# Altium schematic sheet MCU.SchDoc
size A4
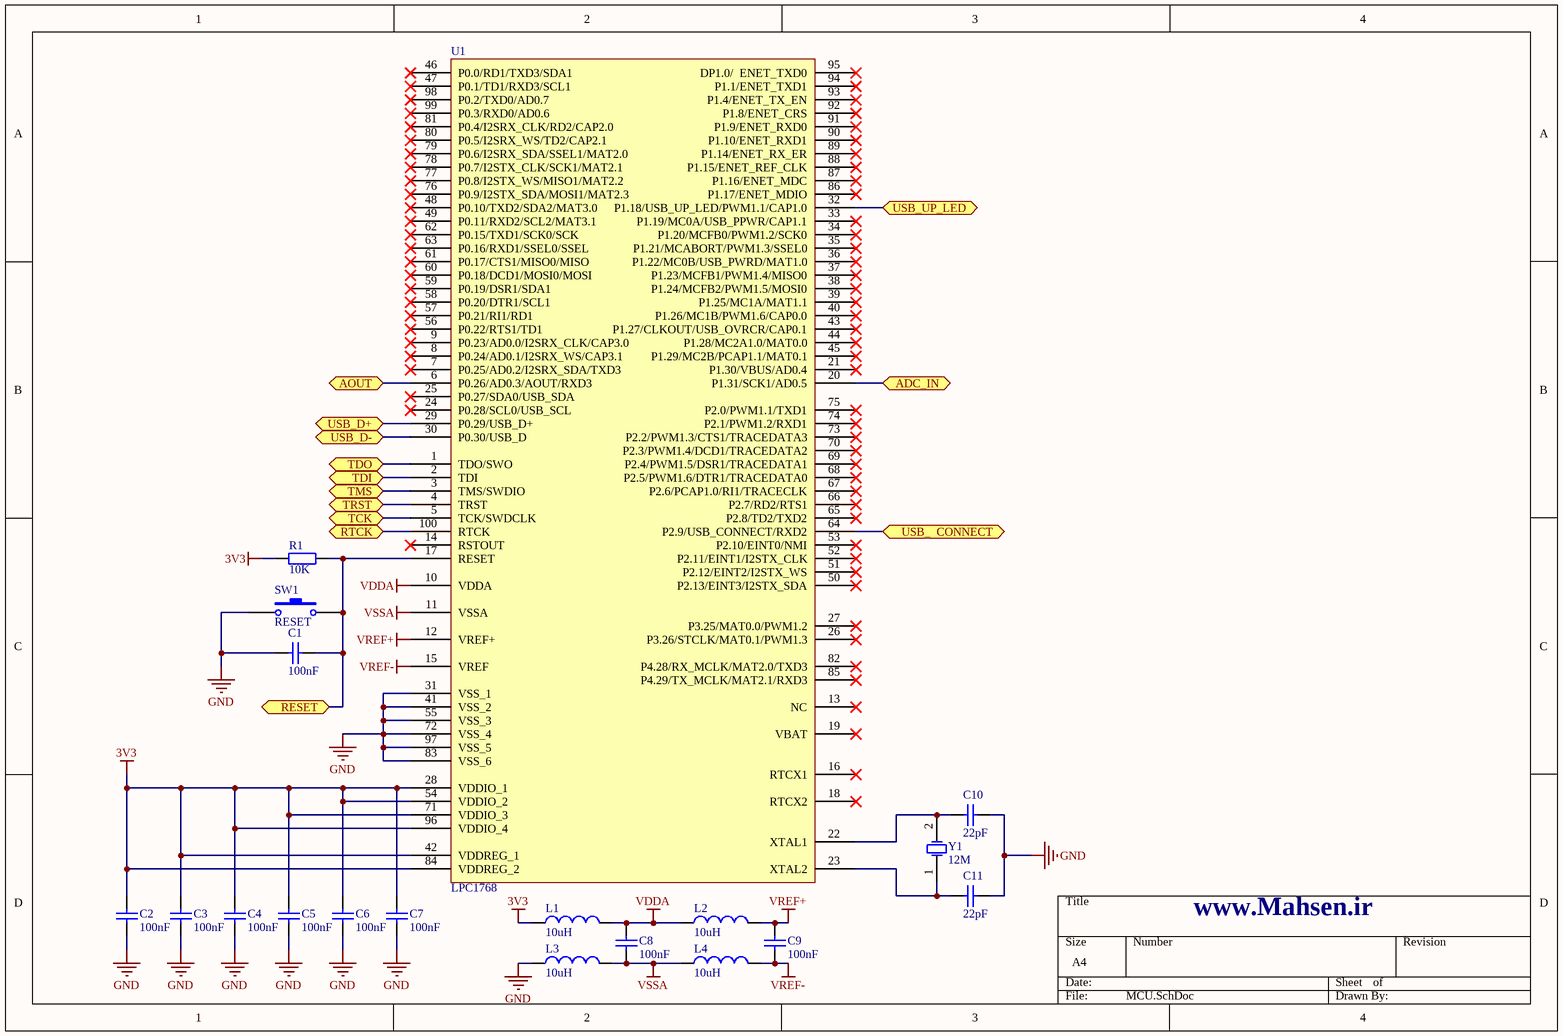
[diagram p0: MCU.SchDoc]

## Parts
C1  100nF  [0805]
C2  100nF  [0805]
C3  100nF  [0805]
C4  100nF  [0805]
C5  100nF  [0805]
C6  100nF  [0805]
C7  100nF  [0805]
C8  100nF  [0805]
C9  100nF  [0805]
C10  22pF  [0805]
C11  22pF  [0805]
L1  10uH  [0402-A]
L2  10uH  [0402-A]
L3  10uH  [0402-A]
L4  10uH  [0402-A]
R1  10K  [0805]
SW1  RESET  [SPST-2]
U1  LPC1768  [LQFP_100]
Y1  12M  [R38]

## Ports
ADC_IN (bidir), AOUT (bidir), RESET (bidir), RTCK (bidir), TCK (bidir), TDI (bidir), TDO (bidir), TMS (bidir), TRST (bidir), USB_  CONNECT (bidir), USB_D+ (bidir), USB_D- (bidir), USB_UP_LED (bidir)

## Nets
3V3: C2.1 C3.1 C4.1 C5.1 C6.1 C7.1 L1.1 R1.1 U1.28(VDDIO_1) U1.42(VDDREG_1) U1.54(VDDIO_2) U1.71(VDDIO_3) U1.84(VDDREG_2) U1.96(VDDIO_4)
GND: C1.2 C2.2 C3.2 C4.2 C5.2 C6.2 C7.2 C10.2 C11.1 L3.1 SW1.1 U1.31(VSS_1) U1.41(VSS_2) U1.55(VSS_3) U1.72(VSS_4) U1.83(VSS_6) U1.97(VSS_5)
VDDA: C8.1 L1.2 L2.1 U1.10(VDDA)
VREF+: C9.1 L2.2 U1.12(VREF+)
VREF-: C9.2 L4.2 U1.15(VREF)
VSSA: C8.2 L3.2 L4.1 U1.11(VSSA)
ADC_IN: U1.20(P1.31/SCK1/AD0.5) ; port ADC_IN
AOUT: U1.6(P0.26/AD0.3/AOUT/RXD3) ; port AOUT
RESET: C1.1 R1.2 SW1.2 U1.17(RESET) ; port RESET
RTCK: U1.100(RTCK) ; port RTCK
TCK: U1.5(TCK/SWDCLK) ; port TCK
TDI: U1.2(TDI) ; port TDI
TDO: U1.1(TDO/SWO) ; port TDO
TMS: U1.3(TMS/SWDIO) ; port TMS
TRST: U1.4(TRST) ; port TRST
USB_  CONNECT: U1.64(P2.9/USB_CONNECT/RXD2) ; port USB_  CONNECT
USB_D+: U1.29(P0.29/USB_D+) ; port USB_D+
USB_D-: U1.30(P0.30/USB_D) ; port USB_D-
USB_UP_LED: U1.32(P1.18/USB_UP_LED/PWM1.1/CAP1.0) ; port USB_UP_LED
NetC10_1: C10.1 U1.22(XTAL1) Y1.2(OSC2)
NetC11_2: C11.2 U1.23(XTAL2) Y1.1(OSC1)

Not connected (* = marked no-connect by the designer): U1 7(P0.25/AD0.2/I2SRX_SDA/TXD3)* 8(P0.24/AD0.1/I2SRX_WS/CAP3.1)* 9(P0.23/AD0.0/I2SRX_CLK/CAP3.0)* 13(NC)* 14(RSTOUT)* 16(RTCX1)* 18(RTCX2)* 19(VBAT)* 21(P1.30/VBUS/AD0.4)* 24(P0.28/SCL0/USB_SCL)* 25(P0.27/SDA0/USB_SDA)* 26(P3.26/STCLK/MAT0.1/PWM1.3)* 27(P3.25/MAT0.0/PWM1.2)* 33(P1.19/MC0A/USB_PPWR/CAP1.1)* 34(P1.20/MCFB0/PWM1.2/SCK0)* 35(P1.21/MCABORT/PWM1.3/SSEL0)* 36(P1.22/MC0B/USB_PWRD/MAT1.0)* 37(P1.23/MCFB1/PWM1.4/MISO0)* 38(P1.24/MCFB2/PWM1.5/MOSI0)* 39(P1.25/MC1A/MAT1.1)* 40(P1.26/MC1B/PWM1.6/CAP0.0)* 43(P1.27/CLKOUT/USB_OVRCR/CAP0.1)* 44(P1.28/MC2A1.0/MAT0.0)* 45(P1.29/MC2B/PCAP1.1/MAT0.1)* 46(P0.0/RD1/TXD3/SDA1)* 47(P0.1/TD1/RXD3/SCL1)* 48(P0.10/TXD2/SDA2/MAT3.0)* 49(P0.11/RXD2/SCL2/MAT3.1)* 50(P2.13/EINT3/I2STX_SDA)* 51(P2.12/EINT2/I2STX_WS)* 52(P2.11/EINT1/I2STX_CLK)* 53(P2.10/EINT0/NMI)* 56(P0.22/RTS1/TD1)* 57(P0.21/RI1/RD1)* 58(P0.20/DTR1/SCL1)* 59(P0.19/DSR1/SDA1)* 60(P0.18/DCD1/MOSI0/MOSI)* 61(P0.17/CTS1/MISO0/MISO)* 62(P0.15/TXD1/SCK0/SCK)* 63(P0.16/RXD1/SSEL0/SSEL)* 65(P2.8/TD2/TXD2)* 66(P2.7/RD2/RTS1)* 67(P2.6/PCAP1.0/RI1/TRACECLK)* 68(P2.5/PWM1.6/DTR1/TRACEDATA0)* 69(P2.4/PWM1.5/DSR1/TRACEDATA1)* 70(P2.3/PWM1.4/DCD1/TRACEDATA2)* 73(P2.2/PWM1.3/CTS1/TRACEDATA3)* 74(P2.1/PWM1.2/RXD1)* 75(P2.0/PWM1.1/TXD1)* 76(P0.9/I2STX_SDA/MOSI1/MAT2.3)* 77(P0.8/I2STX_WS/MISO1/MAT2.2)* 78(P0.7/I2STX_CLK/SCK1/MAT2.1)* 79(P0.6/I2SRX_SDA/SSEL1/MAT2.0)* 80(P0.5/I2SRX_WS/TD2/CAP2.1)* 81(P0.4/I2SRX_CLK/RD2/CAP2.0)* 82(P4.28/RX_MCLK/MAT2.0/TXD3)* 85(P4.29/TX_MCLK/MAT2.1/RXD3)* 86(P1.17/ENET_MDIO)* 87(P1.16/ENET_MDC)* 88(P1.15/ENET_REF_CLK)* 89(P1.14/ENET_RX_ER)* 90(P1.10/ENET_RXD1)* 91(P1.9/ENET_RXD0)* 92(P1.8/ENET_CRS)* 93(P1.4/ENET_TX_EN)* 94(P1.1/ENET_TXD1)* 95(DP1.0/__ENET_TXD0)* 98(P0.2/TXD0/AD0.7)* 99(P0.3/RXD0/AD0.6)*

## Notes on the sheet
- www.Mahsen.ir

## Library data of the parts
C1-C11 = Cap: Capacitor; Published: 8-Jun-2000; LatestRevisionDate: 17-Jul-2002; LatestRevisionNote: Re-released for DXP Platform.; PackageReference: RAD-0.3; Publisher: Altium Limited; PackageDescription: Radial Cap, Thru-Hole; 2 Leads; 0.3 in Pin Spacing
  C1-C9: Value: 100nF
  C10 C11: Value: 22pF
L1-L4 = Inductor: Code_IEC: 1005; Published: 8-Jun-2000; LatestRevisionDate: 29-May-2009; LatestRevisionNote: IPC-7351 Footprint Added.; PackageReference: 0402-A; Publisher: Altium Limited; PackageDescription: Chip Inductor; Code_JEITA: 0402; Value: 10uH
R1 = Res2: Resistor; Published: 8-Jun-2000; LatestRevisionDate: 17-Jul-2002; LatestRevisionNote: Re-released for DXP Platform.; PackageReference: AXIAL-0.4; Publisher: Altium Limited; PackageDescription: Axial Device, Thru-Hole; 2 Leads; 0.4 in Pin Spacing; Value: 10K
SW1 = SW-PB: Switch; Published: 24-Mar-1999; LatestRevisionDate: 17-Jul-2002; LatestRevisionNote: Re-released for DXP Platform.; PackageReference: SPST-2; Publisher: Altium Limited; PackageDescription: Switch; 2 Leads
Y1 = XTAL: Crystal Oscillator; Published: 8-Jun-2000; LatestRevisionDate: 17-Jul-2002; LatestRevisionNote: Re-released for DXP Platform.; PackageReference: R38; Publisher: Altium Limited; PackageDescription: Crystal, Thru-Hole; 2 Leads; Body 3.1 x 8.2 mm (Dia.xH); Value: 12M